# Altium schematic sheet connector.SchDoc: Communication Section
size A4; Author: Marcel Hellwig; Organization: Hamburg Bit-Bots; Address1: Vogt-Kölln-Str. 30; Address2: 22527 Hamburg; Address3: Germany; Address4: www.bit-bots.de; DocumentNumber: 2; SheetNumber: 2; SheetTotal: 4; EMail: info@bit-bots.de
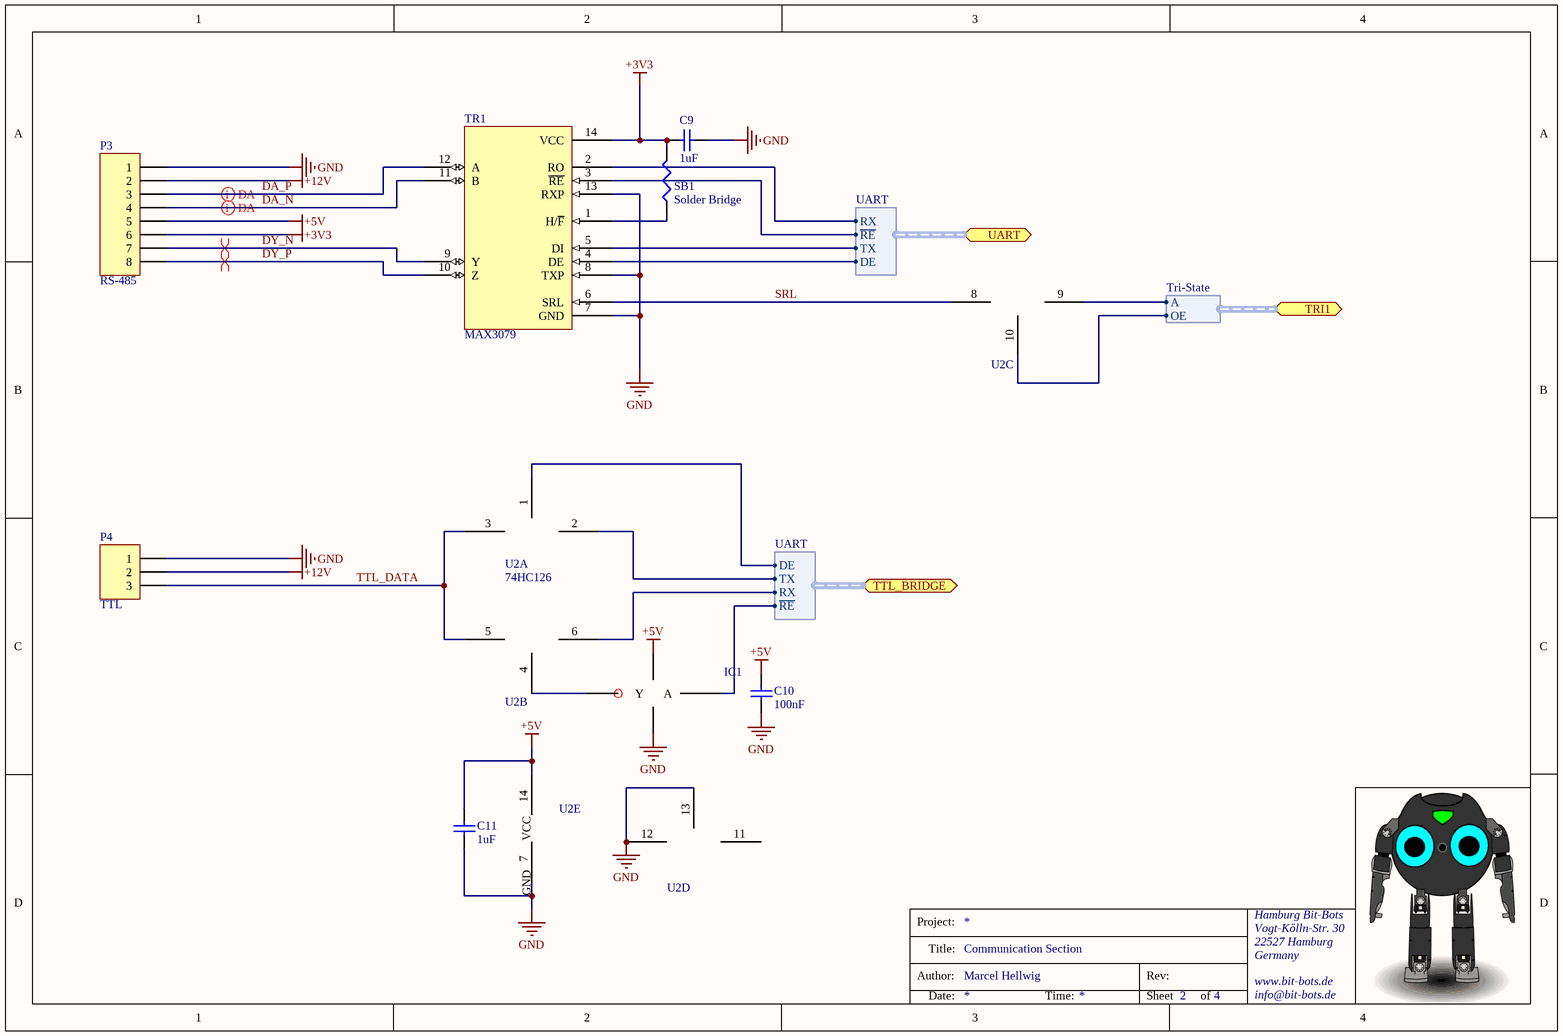
[diagram p0: connector.SchDoc]

## Parts
C9  1uF  [C2012]
C10  100nF  [C2012]
C11  1uF  [C2012]
IC1  74AHC1G04  [SOT-353]  (value not drawn)
P3  RS-485  [8-Pin]
P4  TTL  [3-Pin]
SB1  Solder Bridge  [J1-0603]  (no BOM)
TR1  MAX3079  [SOIC14]
U2  74HC126  [SOIC14]  (parts A,B,C,D,E of 5)

## Ports
TRI1 (harness Tri-State), TTL_BRIDGE (harness UART), UART (harness UART)

## Harnesses
UART: ~{RE}, DE, RX, TX
Tri-State: A, OE

## Nets
+3V3: C9.1 P3.6 SB1.2 TR1.14(VCC)
+5V: C10.2 C11.1 IC1.5(VCC) P3.5 U2.14(VCC)
+12V: P3.2 P4.2
GND: C9.2 C10.1 C11.2 IC1.3(GND) P3.1 P4.1 TR1.7(GND) TR1.8(TXP) TR1.13(RXP) U2.7(GND) U2.12(A4) U2.13(OE4)
DA_N: P3.4 TR1.11(B)
DA_P: P3.3 TR1.12(A)
DY_N: P3.7 TR1.9(Y)
DY_P: P3.8 TR1.10(Z)
SRL: TR1.6(SRL) U2.8(Y3)
TTL_DATA: P4.3 U2.3(Y1) U2.5(A2)
NetIC1_2: IC1.2(A) ; port TTL_BRIDGE.~{RE}
NetIC1_4: IC1.4(Y) U2.4(OE2)
NetSB1_1: SB1.1 TR1.1(H/~{F})
NetTR1_2: TR1.2(RO) ; port UART.RX
NetTR1_3: TR1.3(~{RE}) ; port UART.~{RE}
NetTR1_4: TR1.4(DE) ; port UART.DE
NetTR1_5: TR1.5(DI) ; port UART.TX
NetU2_1: U2.1(OE1) ; port TTL_BRIDGE.DE
NetU2_2: U2.2(A1) ; port TTL_BRIDGE.TX
NetU2_6: U2.6(Y2) ; port TTL_BRIDGE.RX
NetU2_9: U2.9(A3) ; port TRI1.A
NetU2_10: U2.10(OE3) ; port TRI1.OE

Not connected (* = marked no-connect by the designer): U2 11(Y4)

## Layout directives
differential pair: DA_N, DA_P, DY_N, DY_P

## Notes on the sheet
- Project:
- Author:
- Title:
- Rev:
- Date:
- Time:
- Sheet
- of

## Library data of the parts
C9 = Cap Semi: Capacitor; Published: 8-Jun-2000; LatestRevisionDate: 29-May-2009; LatestRevisionNote: IPC-7351 Footprint Added.; PackageReference: C1206; Publisher: Altium Limited; PackageDescription: Chip Capacitor; Value: 1uF
C10 = Cap: Capacitor; Published: 8-Jun-2000; LatestRevisionDate: 17-Jul-2002; LatestRevisionNote: Re-released for DXP Platform.; PackageReference: RAD-0.3; Publisher: Altium Limited; PackageDescription: Radial Cap, Thru-Hole; 2 Leads; 0.3 in Pin Spacing; Value: 100nF
C11 = Cap: Capacitor; Manufacturer: MULTICOMP; Manufacturer Part Number: MC0805B105K250CT; Produktpalette: Baureihe MC; Kapazität: 1; Kapazitätstoleranz: ±10%; Dielektrikum: X7; Nennspannung: 25; Keramikkondensatorgehäuse: 0805 [Metrisch 2012]; Betriebstemperatur, min.: -55; Betriebstemperatur, max.: 125; Verpackung: Gurtabschnitt; Kondensatoranschlüsse: SMD<!--FANDB--><div class="features-and-benefits-container"></div>; Published: 8-Jun-2000; LatestRevisionDate: 17-Jul-2002; LatestRevisionNote: Re-released for DXP Platform.; PackageReference: RAD-0.3; Publisher: Altium Limited; PackageDescription: Radial Cap, Thru-Hole; 2 Leads; 0.3 in Pin Spacing; Value: 1uF; Supplier 1: Farnell; Supplier Part Number 1: 2320827; RoHS: YES; Stock 1: 4031; Pricing 1: 10=0,06, 100=0,05, 500=0,041, 1000=0,034, 1500=0,027 (EUR); MSL: MSL 1 - unbegrenzt; Bauform: 0805 [Metrisch 2012]; Kapazitätstoleranz ±: ±10%; ComponentLink1URL: http://www.farnell.com/datasheets/1870456.pdf; ComponentLink1Description: http://www.farnell.com/datasheets/1870456.pdf
IC1 = 74AHC1G04: Single Logic Inverter; Supplier 1: Farnell; Supplier Part Number 1: 1085239
P3 = Header 8: Header, 8-Pin; LatestRevisionDate: 17-Jul-2002; LatestRevisionNote: Re-released for DXP Platform.; Publisher: Altium Limited
P4 = Header 3: Header, 3-Pin; LatestRevisionDate: 17-Jul-2002; LatestRevisionNote: Re-released for DXP Platform.; Publisher: Altium Limited
SB1 = Res3: Resistor; Value: 1K; Published: 8-Jun-2000; LatestRevisionDate: 29-May-2009; LatestRevisionNote: IPC-7351 Footprint Added.; PackageReference: J1-0603; Publisher: Altium Limited; PackageDescription: Chip Resistor
TR1 = MAX3079: MAX3079 RS485-Transreceiver; Supplier 1: Farnell
U2 = 74HC126: Quad 3-State Noninverting Buffer; Manufacturer: NXP; Manufacturer Part Number: 74HC126D; Supplier 1: Farnell; Supplier Part Number 1: 1085233; RoHS: YES; Stock 1: 198; Pricing 1: 1=0,444, 10=0,311, 100=0,214, 200=0,193, 500=0,173, 2000=0,155, 5000=0,0826, 20000=0,0733 (EUR); ComponentLink1URL: http://www.farnell.com/datasheets/1852048.pdf; ComponentLink1Description: http://www.farnell.com/datasheets/1852048.pdf; ComponentLink2URL: http://www.farnell.com/cad/1638396.zip; ComponentLink2Description: http://www.farnell.com/cad/1638396.zip